# EAGLE schematic nand (EAGLE 5.91)
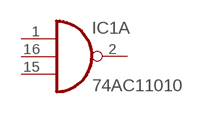
[diagram p0: schematic, sheet 1]

## Parts
IC1  74AC11010  [DIL16]
Unconnected: IC1.1(A:I0) IC1.2(A:O) IC1.3(B:O) IC1.6(C:O) IC1.7(C:I2) IC1.8(C:I1) IC1.9(C:I0) IC1.10(B:I2) IC1.11(B:I1) IC1.14(B:I0) IC1.15(A:I2) IC1.16(A:I1)

## Power pins joined to a net without a drawn wire
GND: IC1.4(P:GND) IC1.5(P:GND)
VCC: IC1.12(P:VCC) IC1.13(P:VCC)

## Library data of the parts
IC1 = 74ac-logic:74AC11010: Triple 3-input NAND